# EAGLE design 212_lcd (EAGLE 7.6.0)
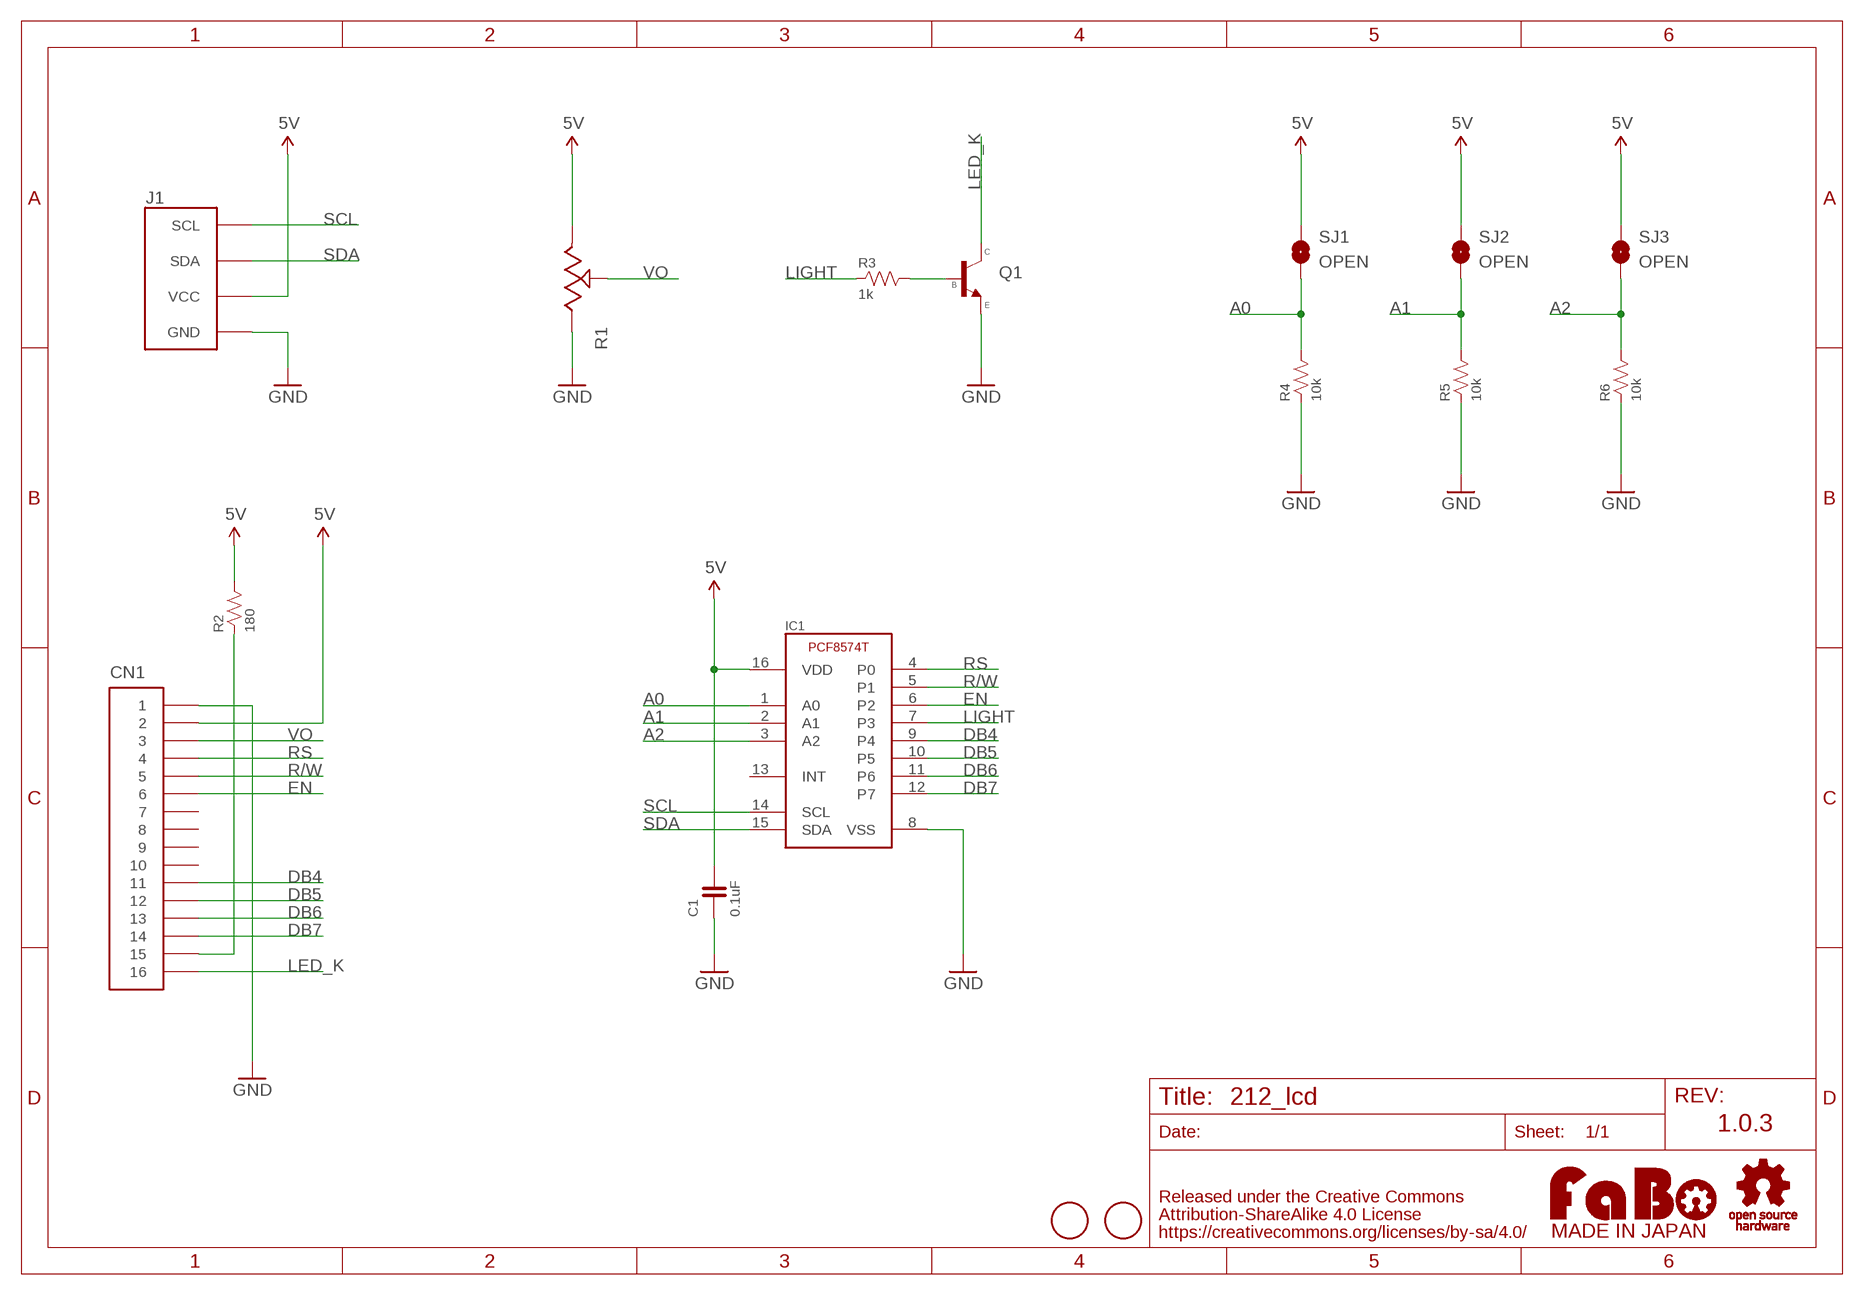
[diagram p0: schematic, sheet 1]

## Parts
C1  0.1uF  CAPACITOR-0603  [0603]
CN1  PIN_HEADER_1X16-LONG  [PIN_1X16_LONG]
IC1  PCF8574T  [SO16]
J1  FABO_BRICK_I2C-S04B-PASK-2_LONG  [FABO_BRICK_I2C_S04B-PASK-2_LONG]
Q1  NPN-SMD  [SOT23]
R1  RESISTOR_VARIABLE-SMD  [TC33X]
R2  180  RESISTOR-0603  [0603]
R3  1k  RESISTOR-0603  [0603]
R4  10k  RESISTOR-0603  [0603]
R5  10k  RESISTOR-0603  [0603]
R6  10k  RESISTOR-0603  [0603]
SJ1  OPEN  SMD-JUMPER-2-OPEN  [SMD-JUMPER-2-OPEN]
SJ2  OPEN  SMD-JUMPER-2-OPEN  [SMD-JUMPER-2-OPEN]
SJ3  OPEN  SMD-JUMPER-2-OPEN  [SMD-JUMPER-2-OPEN]
U$2  LOGO_OSHW-M_BOTTOM  [LOGO_OSHW_M_BOTTOM]
U$3  LOGO_FABO-M  [LOGO_FABO_MS]
U$4  SCREW-PAD-3MM  [SCREWPAD_3MM]
U$5  SCREW-PAD-3MM  [SCREWPAD_3MM]

## Nets
5V: C1.2 CN1.2 IC1.16(VDD) J1.VCC R1.1 R2.2 SJ1.1 SJ2.1 SJ3.1
A0: IC1.1(A0) R4.2 SJ1.2
A1: IC1.2(A1) R5.2 SJ2.2
A2: IC1.3(A2) R6.2 SJ3.2
BASE: Q1.1(B) R3.2
DB4: CN1.11 IC1.9(P4)
DB5: CN1.12 IC1.10(P5)
DB6: CN1.13 IC1.11(P6)
DB7: CN1.14 IC1.12(P7)
EN: CN1.6 IC1.6(P2)
GND: C1.1 CN1.1 IC1.8(VSS) J1.GND Q1.2(E) R1.3 R4.1 R5.1 R6.1
LED_A: CN1.15 R2.1
LED_K: CN1.16 Q1.3(C)
LIGHT: IC1.7(P3) R3.1
R/W: CN1.5 IC1.5(P1)
RS: CN1.4 IC1.4(P0)
SCL: IC1.14(SCL) J1.SCL
SDA: IC1.15(SDA) J1.SDA
VO: CN1.3 R1.2
Unconnected: CN1.7 CN1.8 CN1.9 CN1.10 IC1.13(INT)

## Notes on the sheet
- 1.0.3

## Library data of the parts
C1 = FaBo-Capacitor:CAPACITOR: CAPACITOR
CN1 = FaBo-PIN:PIN_HEADER_1X16
IC1 = FaBo-etc:PCF8574T
J1 = FaBo-Template:FABO_BRICK_I2C: FaBo Brick I2C
Q1 = FaBo-Parts:NPN
R1 = FaBo-Resistors:RESISTOR_VARIABLE
R2-R6 = FaBo-Resistors:RESISTOR: RESISTOR
SJ1-SJ3 = FaBo-Supply:SMD-JUMPER-2
U$2 = FaBo-etc:LOGO_OSHW
U$3 = FaBo-etc:LOGO_FABO
U$4 U$5 = FaBo-etc:SCREW-PAD

## Board
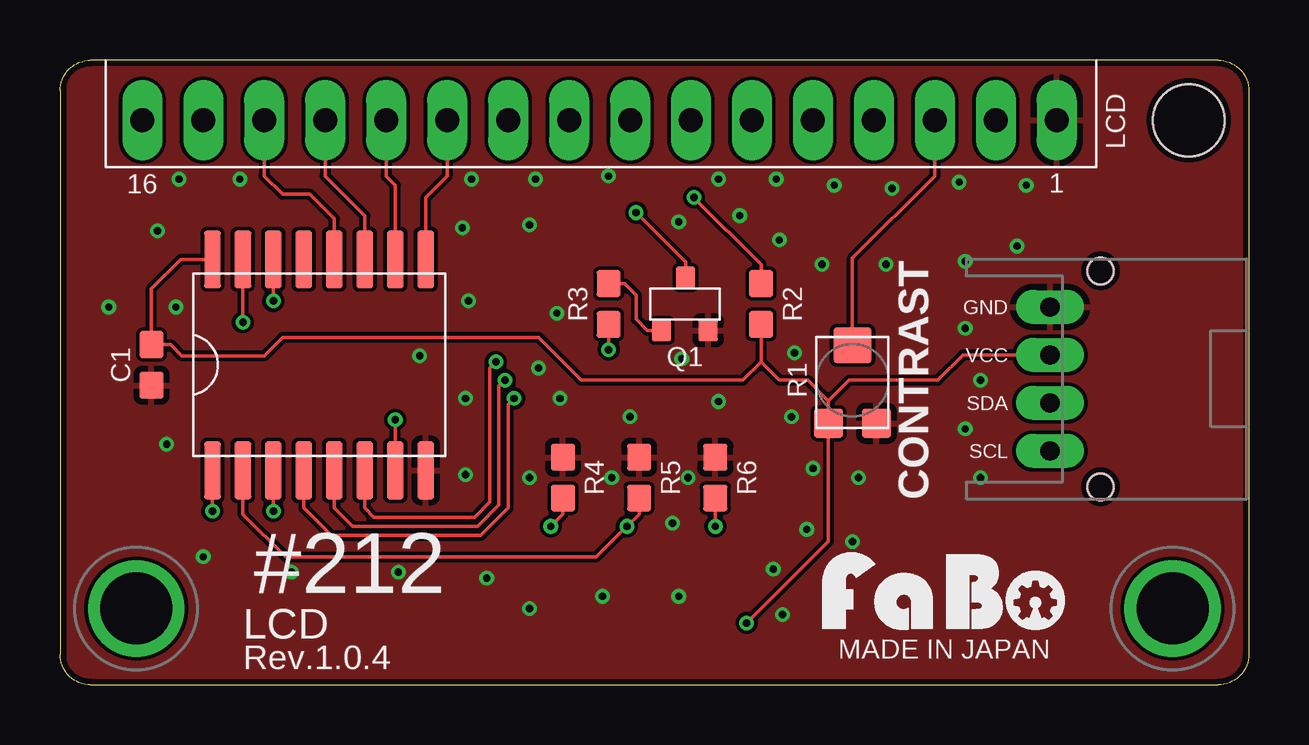
[diagram p1: board, top side]
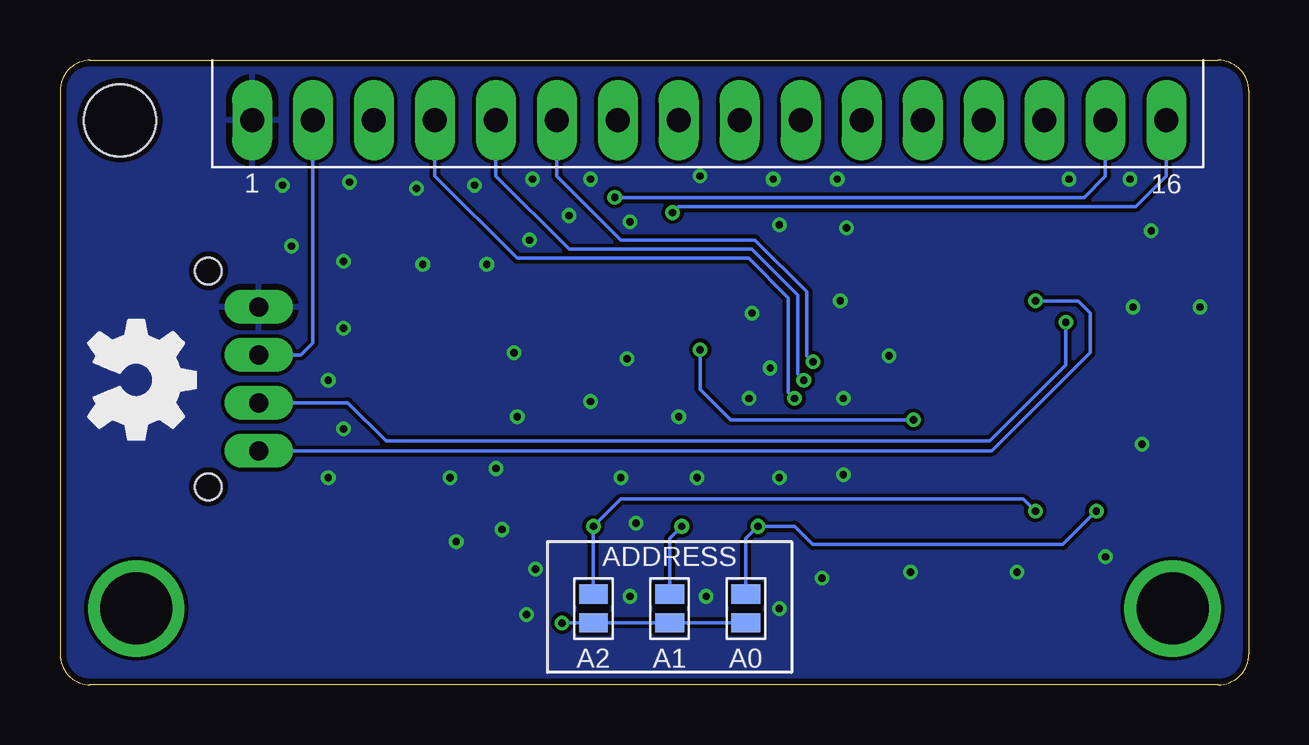
[diagram p2: board, bottom side, seen from below]

Size 49.53 x 26.04 mm. Coordinates in mm from the lower left corner, seen from the top.
Outline: 1.27,0 48.26,0 arc90 49.53,1.27 49.53,24.77 arc90 48.26,26.04 1.27,26.04 arc90 0,24.77 0,1.27 arc90 1.27,0
Copper layers (1*16): Top 0.035mm / dielectric 1.5mm / Bottom 0.035mm
Design rules "SeeedStudio_2layer_DRU_no_angle_20140221": minimum track width 6mil, minimum drill 12mil, track to track 6mil, track to pad 6mil, pad to pad 6mil, via to via 6mil, smd to smd 0mil, copper to edge 10mil, drill to drill 10mil, minimum pad ring 10mil, minimum via ring 6mil, stop-mask expansion 2mil, vias tented up to drill 100mil, thermal gap 10mil
Holes 3 mm at 47.03,23.54

### Footprints (pad centres in the part's own frame; a part is rotated, then mirrored left to right if it is on the bottom)
0603 = smd 1.1 x 1: 1 -0.85,0; 2 0.85,0
PIN_1X16_LONG = drill 1 pad 1.676 long: 1 -19.05,0; 2 -16.51,0; 3 -13.97,0; 4 -11.43,0; 5 -8.89,0; 6 -6.35,0; 7 -3.81,0; 8 -1.27,0; 9 1.27,0; 10 3.81,0; 11 6.35,0; 12 8.89,0; 13 11.43,0; 14 13.97,0; 15 16.51,0; 16 19.05,0
SO16 = smd 2.4 x 0.7: 1 -4.4,4.445; 2 -4.4,3.175; 3 -4.4,1.905; 4 -4.4,0.635; 5 -4.4,-0.635; 6 -4.4,-1.905; 7 -4.4,-3.175; 8 -4.4,-4.445; 9 4.4,-4.445; 10 4.4,-3.175; 11 4.4,-1.905; 12 4.4,-0.635; 13 4.4,0.635; 14 4.4,1.905; 15 4.4,3.175; 16 4.4,4.445
FABO_BRICK_I2C_S04B-PASK-2_LONG = drill 0.8 pad 1.422 long: GND -3,0; SCL 3,0; SDA 1,0; VCC -1,0 | hole 1.1: 4.5,2.1; -4.5,2.1
SOT23 = smd 0.8 x 0.9: 1 -0.97,-1.1; 2 0.97,-1.1; 3 0.03,1.1
TC33X = smd 1.2 x 1.2: 1 -1,-1.8; 3 1,-1.8 | smd 1.6 x 1.5: 2 0,1.45
SMD-JUMPER-2-OPEN = smd 0.8 x 1.2: 1 -0.6,0; 2 0.6,0
SCREWPAD_3MM = drill 3 pad 3.81: 1 0,0

### Placement (x,y rotation side)
C1  3.81,13.34 90 top
CN1  22.48,23.54 180 top
IC1  10.79,13.34 90 top
J1  41.25,12.75 270 top
Q1  26.04,15.88 0 top
R1  33.02,12.7 0 top
R2  29.21,15.88 270 top
R3  22.86,15.88 90 top
R4  20.95,8.64 270 top
R5  24.13,8.64 270 top
R6  27.3,8.64 270 top
SJ1  20.95,3.17 90 bottom
SJ2  24.13,3.17 90 bottom
SJ3  27.3,3.17 90 bottom
U$2  46.35,12.7 90 top
U$3  36.83,1.91 0 top
U$4  3.17,3.17 0 top
U$5  46.35,3.17 0 top

### Tracks (layer width: path | path; a pad name or v marks a point on that pad's centre or on a via)
5V  (via drill 0.3)
  Top 0.152: 29.21,13.46 R2.2 | 32.02,11.83 R1.1 32.02,5.99 v28.61,2.58 | 32.02,11.83 32.89,12.7 36.58,12.7 37.63,13.75 J1.VCC | IC1.16 5.04,17.73 3.81,16.51 C1.2 4.61,14.19 5.08,13.72 8.51,13.72 9.27,14.48 19.94,14.48 21.72,12.7 28.45,12.7 29.21,13.46 | 29.21,13.46 29.97,12.7 31.15,12.7 32.02,11.83
  Bottom 0.152: SJ1.1 SJ2.1 SJ3.1 v28.61,2.58 | CN1.2 38.99,14.26 39.5,13.75 J1.VCC
A0  (via drill 0.3)
  Top 0.152: IC1.1 v6.35,7.24 | R4.2 20.95,7.11 v20.45,6.6
  Bottom 0.152: SJ1.2 20.95,6.1 v20.45,6.6 18.92,6.6 18.16,5.84 7.75,5.84 v6.35,7.24
A1  (via drill 0.3)
  Top 0.152: IC1.2 7.62,7.11 9.4,5.33 22.35,5.33 v23.62,6.6 24.13,7.11 R5.2
  Bottom 0.152: SJ2.2 24.13,6.1 v23.62,6.6
A2  (via drill 0.3)
  Top 0.152: IC1.3 v8.89,7.24 | v27.3,6.6 R6.2
  Bottom 0.152: SJ3.2 v27.3,6.6 26.16,7.75 9.4,7.75 v8.89,7.24
BASE
  Top 0.152: R3.2 23.53,16.73 24,16.26 24,15.24 24.47,14.78 Q1.1
DB4
  Top 0.152: CN1.11 16.13,21.21 15.24,20.32 IC1.9
DB5
  Top 0.152: CN1.12 13.59,21.21 13.97,20.83 IC1.10
DB6
  Top 0.152: CN1.13 11.05,21.21 12.7,19.56 IC1.11
DB7
  Top 0.152: CN1.14 8.51,21.21 9.27,20.45 10.41,20.45 11.43,19.43 IC1.12
EN  (via drill 0.3)
  Top 0.152: IC1.6 12.7,7.37 13.08,6.99 17.27,6.99 17.91,7.62 17.91,13.21 v18.16,13.46
  Bottom 0.152: CN1.6 28.83,21.21 26.16,18.54 20.57,18.54 18.41,16.38 18.41,13.72 v18.16,13.46
GND  (via drill 0.3)
  other vias: 16.89,8.76 16.89,11.94 20.83,11.94 20.7,15.49 17.02,16 23.75,11.18 31.37,9.02 33.27,8.64 22.99,8.64 30.48,11.18 25.91,13.59 30.1,2.92 29.72,4.83 25.53,6.73 19.56,8.64 17.78,4.45 34.67,20.7 32.26,20.83 29.84,21.08 27.43,21.08 29.97,18.54 28.32,19.56 25.78,19.3 31.75,17.53 37.47,20.95 40.26,20.83 34.42,17.53 37.72,17.65 19.56,19.18 19.81,21.08 4.06,18.92 4.95,21.08 7.49,21.08 16.76,19.05 17.14,21.08 4.83,15.75 2.03,15.75 4.45,10.03 5.97,5.33 9.65,4.7 14.1,4.7 38.35,8.64 37.72,10.67 38.35,12.7 37.72,14.86 33.02,5.97 30.61,13.84 22.86,21.21 22.61,3.68 25.78,3.68 19.56,3.17 26.16,8.64 27.43,11.81 31.11,6.48 14.99,13.72 19.94,13.21 39.88,18.29
  pour Bottom: 0,0 49.53,0 49.53,26.04 0,26.04
  pour Top: 0,0 49.53,0 49.53,26.04 0,26.04
LED_A  (via drill 0.3)
  Top 0.152: R2.1 29.21,17.53 v26.42,20.32
  Bottom 0.152: v26.42,20.32 6.86,20.32 5.97,21.21 CN1.15
LED_K  (via drill 0.3)
  Top 0.152: Q1.3 26.07,17.62 v24,19.68
  Bottom 0.152: CN1.16 3.43,21.21 4.7,19.94 23.75,19.94 v24,19.68
LIGHT  (via drill 0.3)
  Top 0.152: IC1.7 v13.97,11.05 | v22.86,13.97 R3.1
  Bottom 0.152: v13.97,11.05 21.59,11.05 22.86,12.32 v22.86,13.97
R/W  (via drill 0.3)
  Top 0.152: IC1.5 11.43,7.37 12.19,6.6 17.4,6.6 18.29,7.49 18.29,12.45 v18.54,12.7
  Bottom 0.152: CN1.5 31.37,21.21 28.32,18.16 20.7,18.16 18.8,16.26 18.8,12.95 v18.54,12.7
RS  (via drill 0.3)
  Top 0.152: IC1.4 10.16,7.37 11.3,6.22 17.53,6.22 18.67,7.37 18.67,11.68 v18.92,11.94
  Bottom 0.152: CN1.4 33.91,21.21 30.48,17.78 20.83,17.78 19.18,16.13 19.18,12.19 v18.92,11.94
SCL  (via drill 0.3)
  Top 0.152: IC1.14 v8.89,16
  Bottom 0.152: J1.SCL 10.7,9.75 6.6,13.84 6.6,15.49 7.11,16 v8.89,16
SDA  (via drill 0.3)
  Top 0.152: IC1.15 v7.62,15.11
  Bottom 0.152: v7.62,15.11 7.62,13.34 10.79,10.16 35.94,10.16 37.53,11.75 J1.SDA
VO
  Top 0.152: CN1.3 36.45,21.21 33.02,17.78 R1.2

### Text on the board
tPlace: LCD | 16 | 1 | GND | VCC | CONTRAST | SDA | SCL | #212 | LCD | MADE IN JAPAN | Rev.1.0.4
bPlace: 16 | 1 | ADDRESS | A0 | A1 | A2